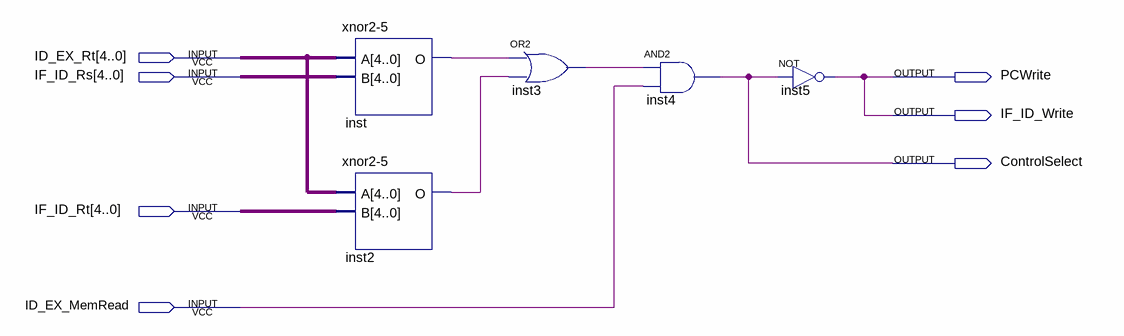
[diagram p0: schematic sheet]
// Quartus schematic HazardDetectionUnit.bdf as structural Verilog: 5 symbols, 7 pins
module HazardDetectionUnit (
  input  [4:0] ID_EX_Rt,
  input  [4:0] IF_ID_Rs,
  input  [4:0] IF_ID_Rt,
  input  ID_EX_MemRead,
  output PCWrite,
  output IF_ID_Write,
  output ControlSelect
);

  wire inst2_o, inst3_out, inst_o;

  \xnor2-5  inst (.A(ID_EX_Rt), .B(IF_ID_Rs), .O(inst_o));
  \xnor2-5  inst2 (.A(ID_EX_Rt), .B(IF_ID_Rt), .O(inst2_o));
  or inst3 (inst3_out, inst_o, inst2_o);
  and inst4 (ControlSelect, inst3_out, ID_EX_MemRead);
  not inst5 (IF_ID_Write, ControlSelect);

  assign PCWrite = IF_ID_Write;
endmodule
